# Altium schematic sheet Sheet1.SchDoc
size A; SheetNumber: 1; SheetTotal: 1
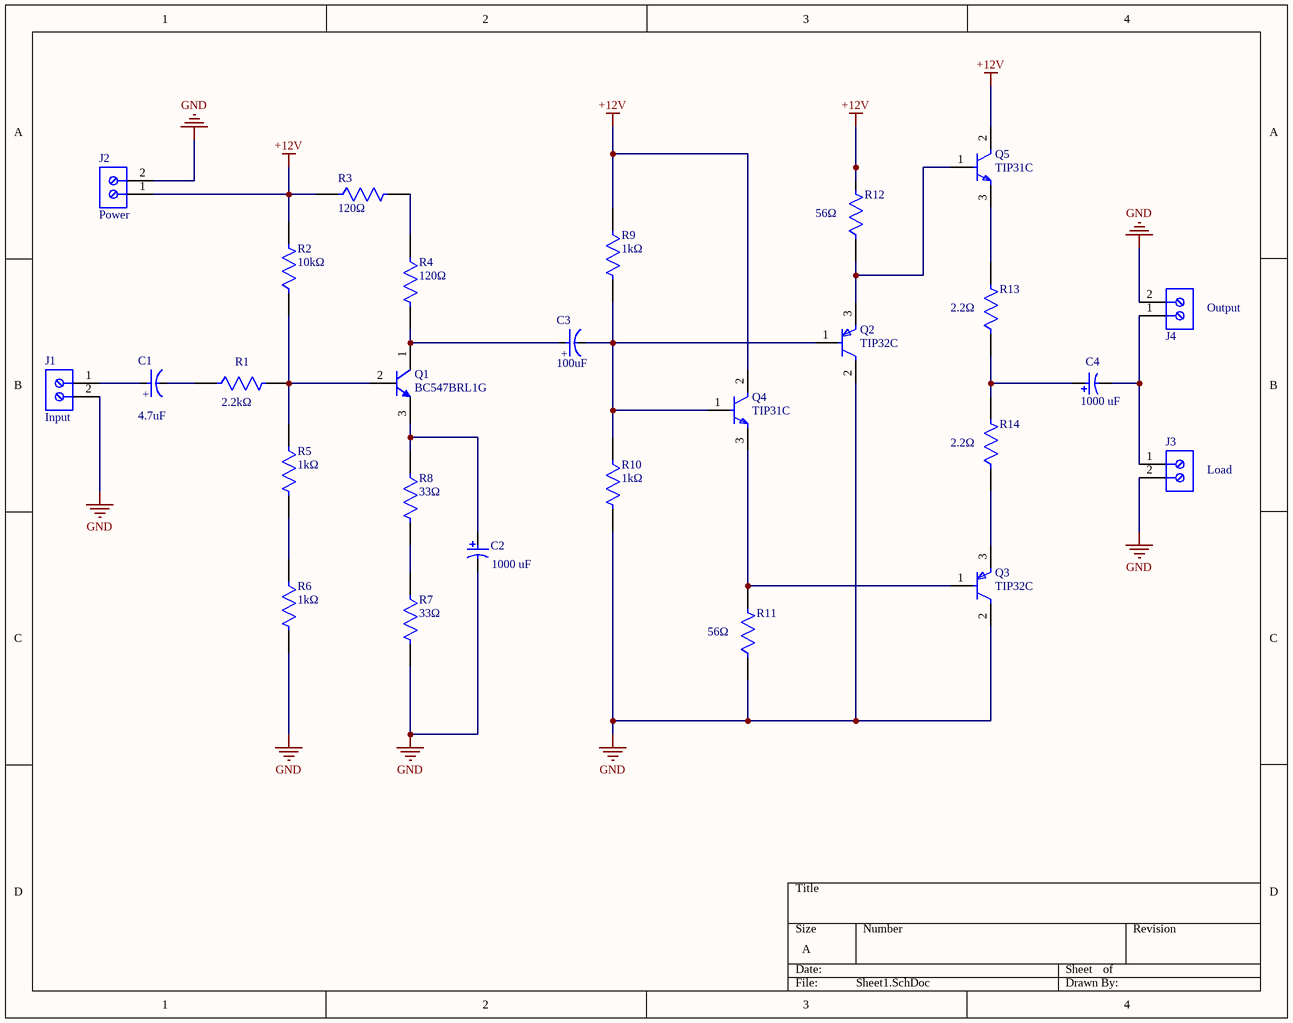
[diagram p0: Sheet1.SchDoc]

## Parts
C1  Capacitance: 4.7uF  [FP-RAD-TH-D_5_0_5-L_11_1-MFG]  (hidden comment: EEUFM1H220_small)
C2  Rated Capacitance: 1000 uF  [NIC-PLF-10x13-2_V]  (hidden comment: PLF1A471MDO1_big)
C3  Capacitance: 100uF  [FP-RAD-TH-D_5_0_5-L_11_1-MFG]  (hidden comment: EEUFM1H220_small)
C4  Rated Capacitance: 1000 uF  [NIC-PLF-10x13-2_V]  (hidden comment: PLF1A471MDO1_big)
J1  Input  [TECO-282836-2_V]
J2  Power  [TECO-282836-2_V]
J3  Load  [TECO-282836-2_V]
J4  Output  [TECO-282836-2_V]
Q1  BC547BRL1G  [ONSC-TO-92-3-29-11_AM_BL]
Q2  TIP32C  [FP-TO-220-P0A0015988-MFG]
Q3  TIP32C  [FP-TO-220-P0A0015988-MFG]
Q4  TIP31C  [FP-TO-220-P0A0015988-MFG]
Q5  TIP31C  [FP-TO-220-P0A0015988-MFG]
R1  value 2.2kΩ  [FP-MFR-25-MFG]  (hidden comment: MFR-25FBF52-1K18)
R2  value 10kΩ  [FP-MFR-25-MFG]  (hidden comment: MFR-25FBF52-1K18)
R3  Resistance: 120Ω  [FP-MFR-25-MFG]  (hidden comment: MFR-25FBF52-1K18)
R4  Resistance: 120Ω  [FP-MFR-25-MFG]  (hidden comment: MFR-25FBF52-1K18)
R5  value 1kΩ  [FP-MFR-25-MFG]  (hidden comment: MFR-25FBF52-1K18)
R6  value 1kΩ  [FP-MFR-25-MFG]  (hidden comment: MFR-25FBF52-1K18)
R7  Resistance: 33Ω  [FP-MFR-25-MFG]  (hidden comment: MFR-25FBF52-1K18)
R8  Resistance: 33Ω  [FP-MFR-25-MFG]  (hidden comment: MFR-25FBF52-1K18)
R9  value 1kΩ  [FP-MFR-25-MFG]  (hidden comment: MFR-25FBF52-1K18)
R10  value 1kΩ  [FP-MFR-25-MFG]  (hidden comment: MFR-25FBF52-1K18)
R11  Resistance: 56Ω  [FP-15FR010E-MFG]  (hidden comment: 15FR010E)
R12  Resistance: 56Ω  [FP-15FR010E-MFG]  (hidden comment: 15FR010E)
R13  Resistance: 2.2Ω  [FP-15FR010E-MFG]  (hidden comment: 15FR010E)
R14  Resistance: 2.2Ω  [FP-15FR010E-MFG]  (hidden comment: 15FR010E)

## Nets
+12V: J2.1 Q4.2(C) Q5.2(C) R2.2 R3.1 R9.1 R12.2
GND: C2.2 J1.2 J2.2 J3.2 J4.2 Q2.2(C) Q3.2(C) R6.2 R7.2 R10.2 R11.1
NetC1_1: C1.1(C) R1.1
NetC1_2: C1.2(A) J1.1
NetC2_1: C2.1 Q1.3(E) R8.1
NetC3_1: C3.1(C) Q2.1(B) Q4.1(B) R9.2 R10.1
NetC3_2: C3.2(A) Q1.1(C) R4.2
NetC4_1: C4.1 R13.1 R14.2
NetC4_2: C4.2 J3.1 J4.1
NetQ1_2: Q1.2(B) R1.2 R2.1 R5.1
NetQ2_3: Q2.3(E) Q5.1(B) R12.1
NetQ3_1: Q3.1(B) Q4.3(E) R11.2
NetQ3_3: Q3.3(E) R14.1
NetQ5_3: Q5.3(E) R13.2
NetR3_2: R3.2 R4.1
NetR5_2: R5.2 R6.1
NetR7_1: R7.1 R8.2

## Notes on the sheet
- (in symbol CMP-05427-000661-1) +

## Library data of the parts
C1 C3 = CMP-05427-000661-1: Aluminum Electrolytic Capacitors (Radial Lead Type) 22uF ±20% 50V; Impedance: 340mR; Life (Hours): 2000Hour; Dissipation Factor: 0.1%; Ripple Current: 250mA; Lead Diameter: 0.5mm; REACH SVHC: No SVHC; Tolerance: 20%; Max Operating Temperature: 105°C; RoHS Compliant: Yes; Height - Seated (Max): 0.492inch; Number of Pins: 2; Case/Package: Radial; Series: FM; ESR (Equivalent Series Resistance): 340mR; Length: 11mm; Radiation Hardening: No; Voltage: 50V; Min Operating Temperature: -40°C; Voltage Rating: 50V; Voltage Rating (DC): 50V; Lead Free: Lead Free; Package Quantity: 200; Lead Pitch: 2mm; Height: 11mm; Mount: Through Hole; Construction: RADIAL; Termination: Radial; Diameter: 5mm; Packaging: Bulk
C2 C4 = CMP-1234-00001-1: Aluminum Electrolytic Capacitor, 470 uF +/-20%, 10 V, -55 to 105 degC, 2-Pin THD, RoHS; Manufacturer: Nichicon; Leakage Current: 0.94 mA; Rated Ripple: 5700 mA; Rated Voltage: 10 V; ComponentLink3URL: http://nichicon-us.com/english/products/pdfs/e-lf.pdf; PackageDescription: 2-Pin Through Hole Device, Dia 10 mm, Body Length 13 mm, Pin Spacing 5 mm; ComponentLink2URL: http://nichicon-us.com/english/products/pdfs/e-lf.pdf; RoHS: TRUE; ComponentLink1URL: http://www.nichicon.co.jp/; ComponentLink2Description: Datasheet; Capacitance Tolerance: +/-20%; ComponentLink1Description: Manufacturer URL; Mounting Technology: Through Hole; ComponentLink3Description: Package Specification; Temperature Range: -55 to 105 degC; DatasheetVersion: Sep-13; PartNumber: PLF1A471MDO1
J1-J4 = CMP-1684-00017-1: Female Header, Pitch 5 mm, 1 x 2 Position, Height 10 mm, Tail Length 3.5 mm, Rohs, Bulk; Manufacturer: TE Connectivity; Wire Gauge: 16-30AWG; Product Training Modules: Wire-to-BoardEurostyleTerminalBlocks; Clamp Material - Plating: Brass-NickelPlated; Voltage: 300V; Mating Orientation: HorizontalwithBoard; Current: 13.5A; Pitch: 0.197"(5.00mm); Screw Thread: M3; 3D Model: 282836-2.pdf; Other Names: 5ULV-02B / A98076; Dynamic Catalog: BuchananSeries; Number of Levels: 1; Torque - Screw: 0.68Nm(6Lb-In); Featured Product: EurostyleTerminalBlockConnectors; Positions Per Level: 2; Wire Termination: Screw-RisingCageClamp; Datasheet URL: http://www.te.com.cn/commerce/DocumentDelivery/DDEController?Action=showdoc&DocId=Catalog+Section%7F1308389_EUROSTYLE_TERMINAL_BLOCKS%7F0607%7Fpdf%7FEnglish%7FENG_CS_1308389_EUROSTYLE_TERMINAL_BLOCKS_0607.pdf%7F282836-2; Color: Green; Family: TerminalBlocks-WiretoBoard; RoHS Information: 282836-2StatementofCompliance; Standard Package: 300; Contact Material - Plating: Brass-TinPlated; Manufacturer URL: http://www.te.com; Housing Material: Polyamide(PA66),Nylon6/6; Features: Interlocking(Side); Package Description: Female Header, Pitch 5 mm, 1 x 2 Position, Height 10 mm, Tail Length 3.5 mm; Mounting Type: ThroughHole; Package Reference: THD; Packaging: Bulk; Series: Buchanan; Category: Connectors,Interconnects; Screw Material - Plating: Brass-NickelPlated
Q1 = CMP-1048-01605-1: Amplifier Transistor, NPN Silicon, 3-Pin TO-92, Pb-Free, Tape and Reel; Manufacturer: On Semiconductor; IC Continuous (A): 0.1; fT Min (MHz): 150; ComponentLink2URL: http://www.onsemi.com/pub_link/Collateral/BC546-D.PDF; ComponentLink1URL: http://www.onsemi.com/; ComponentLink2Description: Datasheet; RoHS: TRUE; ComponentLink3Description: Package Specification; ComponentLink1Description: Manufacturer URL; ComponentLink3URL: http://www.onsemi.com/pub_link/Collateral/MAC97-D.PDF; PackageDescription: 3-Pin Transistor Outline, Body 4.825 x 3.685 mm, Pitch 1.27 mm; Packing: Tape and Reel; PackageVersion: Rev. AM; Polarity: NPN; DatasheetVersion: Rev. 7; Mounting Technology: Through Hole; PackageReference: TO-92-3-29-11_AM_BL; PartNumber: BC547BRL1G
Q2 Q3 = CMP-12195-000005-1: TRANS PNP 100V 3A TO-220; Manufacturer: STMicroelectronics; Standoff Height: 3.5mm; Number Of Pnp: 1; Max Collector Current: -3A; Emitter Base Voltage: -5V; Collector Emitter Voltage: -100V; Hfe Testvce: -4V; Hfe Max: 50; Collector Emitter Saturation Voltage: -1.2V; Power Dissipation: 2W; Max Junction Temp: +150°C; Hfe Min: 10; Device Class L3: BJTs; Mouser Description: Original ST Microelectronics Transistor, 100V, 3A, .22 Ohm, TO-220 Package; ComponentLink2Description: Datasheet; Device Class L1: Discrete Semiconductors; Automotive: No; Number Of Elements: 1; Category: Trans; Collector Base Voltage: -100V; Package: TO-220-P0A0015988; Height: 19.68mm; Lead Free: Yes; ComponentLink2URL: https://www.st.com/resource/en/datasheet/tip32c.pdf; Hfe Testic: -3A; RoHS: TRUE; Temperature Range High: +150°C; Temperature: to +150°C; Device Class L2: Transistors; Digikey Description: TRANS PNP 100V 3A TO-220; Octopart: https://octopart.com/tip32c-stmicroelectronics-353617; Manufacturer Part Number: TIP32C
Q4 Q5 = CMP-12195-000001-1: TRANS NPN 100V 3A TO-220; Manufacturer: STMicroelectronics; Hfe Max: 50; Number Of Npn: 1; Max Junction Temp: +150°C; Standoff Height: 3.5mm; Emitter Base Voltage: 5V; Collector Emitter Saturation Voltage: 1.2V; Power Dissipation: 2W; Hfe Testvce: 4V; Hfe Min: 10; Device Class L2: Transistors; ComponentLink2URL: https://www.st.com/resource/en/datasheet/tip31c.pdf; Device Class L1: Discrete Semiconductors; Digikey Description: TRANS NPN 100V 3A TO-220; Max Collector Current: 3A; RoHS: TRUE; Height: 19.68mm; Mouser Description: Bipolar Transistors - BJT NPN Gen Pur Power; Number Of Elements: 1; Package: TO-220-P0A0015988; Temperature: to +150°C; Octopart: https://octopart.com/tip31c-stmicroelectronics-15555; Manufacturer Part Number: TIP31C; Category: Trans; Hfe Testic: 3A; Lead Free: Yes; Collector Base Voltage: 100V; Device Class L3: BJTs; Collector Emitter Voltage: 100V; Automotive: No; ComponentLink2Description: Datasheet; Temperature Range High: +150°C
R1 R2 R5 R6 R9 R10 = CMP-03413-000001-1: RES 1.18K OHM 1/4W 1% AXIAL; Manufacturer: Yageo; Temperature Coefficient: 100ppm/°C; Power Rating: 0.25W; Voltage Rating: 250V; Temperature: -55°C to +155°C; Automotive: No; Temperature Range High: +155°C; Mouser Description: Metal Film Resistors 1.18K OHM 1/4W 1%; Digikey Description: RES 1.18K OHM 1/4W 1% AXIAL; Lead Free: Yes; Tolerance: 1%; ComponentLink2Description: Datasheet; ComponentLink2URL: https://www.yageo.com/upload/media/product/products/datasheet/lr/Yageo_LR_MFR_1.pdf; Temperature Range Low: -55°C; Package: MFR-25; Ipc Land Pattern Name: RESAD1000W75L680D260; Composition: Metal Film; Category: Res; Octopart: https://octopart.com/mfr-25fbf52-1k18-yageo-56251681; Series: MFR; Device Class L2: Resistors; Height: 2.6mm; Device Class L3: Through-Hole Resistors; Manufacturer Part Number: MFR-25FBF52-1K18; RoHS: TRUE; Device Class L1: Passive Components
  R1: Resistance: 2.2kΩ
  R2: Resistance: 10kΩ
  R5 R6 R9 R10: Resistance: 1kΩ
R3 R4 = CMP-03413-000001-1: RES 1.18K OHM 1/4W 1% AXIAL; Manufacturer: Yageo; Value: 120Ω; Temperature Coefficient: 100ppm/°C; Power Rating: 0.25W; Voltage Rating: 250V; Temperature: -55°C to +155°C; Automotive: No; Temperature Range High: +155°C; Mouser Description: Metal Film Resistors 1.18K OHM 1/4W 1%; Digikey Description: RES 1.18K OHM 1/4W 1% AXIAL; Lead Free: Yes; Tolerance: 1%; ComponentLink2Description: Datasheet; ComponentLink2URL: https://www.yageo.com/upload/media/product/products/datasheet/lr/Yageo_LR_MFR_1.pdf; Temperature Range Low: -55°C; Package: MFR-25; Ipc Land Pattern Name: RESAD1000W75L680D260; Composition: Metal Film; Category: Res; Octopart: https://octopart.com/mfr-25fbf52-1k18-yageo-56251681; Series: MFR; Device Class L2: Resistors; Height: 2.6mm; Device Class L3: Through-Hole Resistors; Manufacturer Part Number: MFR-25FBF52-1K18; RoHS: TRUE; Device Class L1: Passive Components
R7 R8 = CMP-03413-000001-1: RES 1.18K OHM 1/4W 1% AXIAL; Manufacturer: Yageo; Value: 33Ω; Temperature Coefficient: 100ppm/°C; Power Rating: 0.25W; Voltage Rating: 250V; Temperature: -55°C to +155°C; Automotive: No; Temperature Range High: +155°C; Mouser Description: Metal Film Resistors 1.18K OHM 1/4W 1%; Digikey Description: RES 1.18K OHM 1/4W 1% AXIAL; Lead Free: Yes; Tolerance: 1%; ComponentLink2Description: Datasheet; ComponentLink2URL: https://www.yageo.com/upload/media/product/products/datasheet/lr/Yageo_LR_MFR_1.pdf; Temperature Range Low: -55°C; Package: MFR-25; Ipc Land Pattern Name: RESAD1000W75L680D260; Composition: Metal Film; Category: Res; Octopart: https://octopart.com/mfr-25fbf52-1k18-yageo-56251681; Series: MFR; Device Class L2: Resistors; Height: 2.6mm; Device Class L3: Through-Hole Resistors; Manufacturer Part Number: MFR-25FBF52-1K18; RoHS: TRUE; Device Class L1: Passive Components
R11-R14 = CMP-33362-000004-1: RES 0.01 OHM 5W 1% AXIAL; Voltage Rating: 100mV; Lead Diameter: 0.05mm; Lead Length: 39.7mm; Voltage Rating (DC): 1kV; Temperature Coefficient: 100ppm/°C; Voltage Rating (AC): 220mV; Package Quantity: 10; Power Rating: 5W; Diameter: 8.4mm; Packaging: Bulk; Termination: Axial; Min Operating Temperature: -55°C; Max Operating Temperature: 275°C; Length: 23.8mm; RoHS Compliant: Yes; Lead Free: Lead Free; Mount: Through Hole; Max Power Dissipation: 5W; Tolerance: 1%; Case/Package: Axial; Number of Terminations: 2; Resistor Type: Metal Element